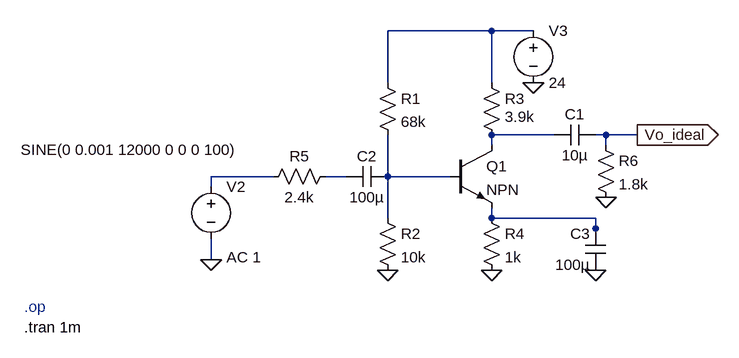
[diagram p0: schematic EM.asc]
EM.asc, the LTspice schematic file:
Version 4.1
SHEET 1 1008 680
WIRE 624 -160 464 -160
WIRE 688 -160 624 -160
WIRE 464 -80 464 -160
WIRE 624 -80 624 -160
WIRE 720 0 624 0
WIRE 800 0 784 0
WIRE 848 0 800 0
WIRE 624 16 624 0
WIRE 800 16 800 0
WIRE 288 64 192 64
WIRE 400 64 368 64
WIRE 464 64 464 0
WIRE 560 64 464 64
WIRE 192 80 192 64
WIRE 464 128 464 64
WIRE 624 128 624 112
WIRE 784 128 624 128
WIRE 784 144 784 128
WIRE 784 160 784 144
WIRE 192 192 192 160
FLAG 464 208 0
FLAG 624 208 0
FLAG 192 192 0
FLAG 784 208 0
FLAG 848 0 Vo_ideal
IOPIN 848 0 Out
FLAG 688 -80 0
FLAG 800 96 0
DATAFLAG 912 -16 ""
DATAFLAG 912 -16 ""
SYMBOL cap 400 80 R270
WINDOW 0 32 32 VTop 2
WINDOW 3 0 32 VBottom 2
SYMATTR InstName C2
SYMATTR Value 100µ
SYMBOL res 448 -96 R0
SYMATTR InstName R1
SYMATTR Value 68k
SYMBOL res 448 112 R0
SYMATTR InstName R2
SYMATTR Value 10k
SYMBOL npn 560 16 R0
SYMATTR InstName Q1
SYMBOL res 608 -96 R0
WINDOW 3 36 68 Left 2
SYMATTR Value 3.9k
SYMATTR InstName R3
SYMBOL res 608 112 R0
SYMATTR InstName R4
SYMATTR Value 1k
SYMBOL cap 784 -16 R90
WINDOW 0 0 32 VBottom 2
WINDOW 3 32 32 VTop 2
SYMATTR InstName C1
SYMATTR Value 10µ
SYMBOL voltage 192 64 R0
WINDOW 3 -293 -41 Left 2
WINDOW 123 24 124 Left 2
WINDOW 39 0 0 Left 0
SYMATTR Value SINE(0 0.001 12000 0 0 0 100)
SYMATTR Value2 AC 1
SYMATTR InstName V2
SYMBOL cap 800 208 R180
WINDOW 0 24 56 Left 2
WINDOW 3 24 8 Left 2
SYMATTR InstName C3
SYMATTR Value 100µ
SYMBOL voltage 688 -176 R0
WINDOW 123 0 0 Left 0
WINDOW 39 0 0 Left 0
SYMATTR InstName V3
SYMATTR Value 24
SYMBOL res 384 48 R90
WINDOW 0 0 56 VBottom 2
WINDOW 3 32 56 VTop 2
SYMATTR InstName R5
SYMATTR Value 2.4k
SYMATTR SpiceLine tol=1 pwr=0.1
SYMBOL res 784 0 R0
SYMATTR InstName R6
SYMATTR Value 1.8k
TEXT -96 264 Left 2 ;.op
TEXT -96 296 Left 2 !.tran 1m

The netlist it stands for:
* EM.asc
C2 N004 N005 100µ
R1 N001 N005 68k
R2 N005 0 10k
Q1 N002 N005 N006 0 NPN
R3 N001 N002 3.9k
R4 N006 0 1k
C1 Vo_ideal N002 10µ
V2 N003 0 SINE(0 0.001 12000 0 0 0 100) AC 1
C3 0 N006 100µ
V3 N001 0 24
R5 N004 N003 2.4k tol=1 pwr=0.1
R6 Vo_ideal 0 1.8k
.model NPN NPN
.model PNP PNP
.lib standard.bjt
* .op
.tran 1m
.backanno
.end